# Altium project CarrierBoard.PrjPcb
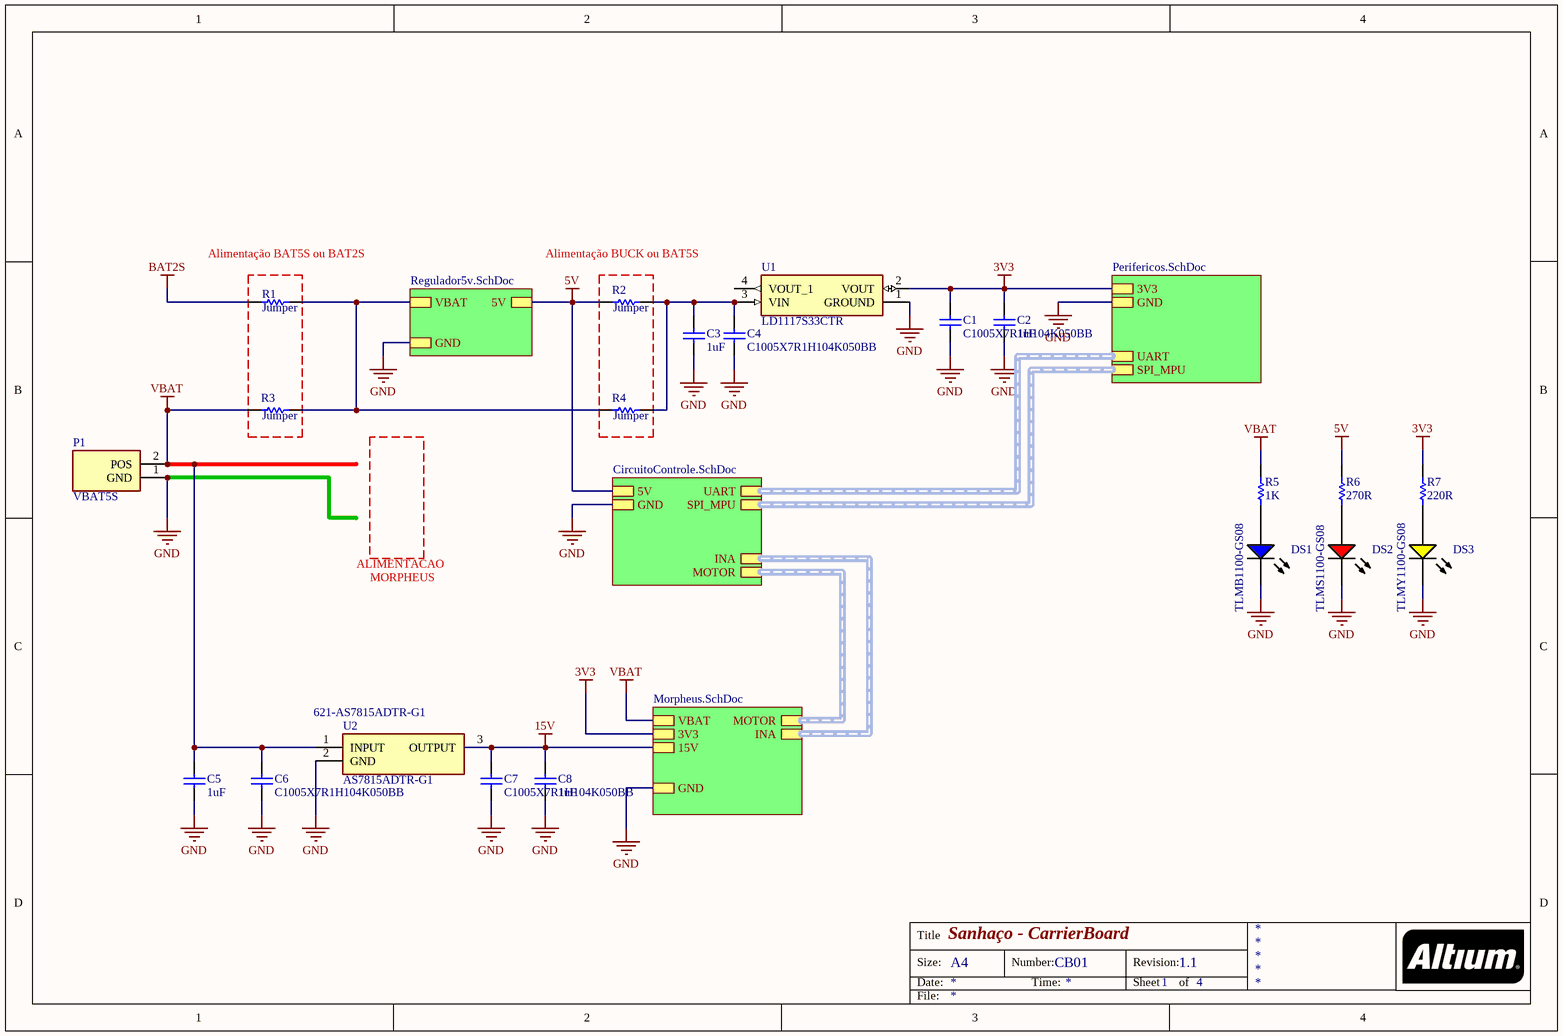
[diagram p0: CarrierBoard.SchDoc]
5 sheets, 58 parts. Net scope: hierarchical (ports join the sheet entries above them; power ports are global).
Board file: CarrierBoard.PcbDoc
Sheets:
  CarrierBoard.SchDoc
    Designator = Regulador5V.SchDoc
    Designator = Perifericos.SchDoc
    Designator = CircuitoControle.SchDoc
    Designator = Morpheus.SchDoc

## Sheet CarrierBoard.SchDoc: Sanhaço - CarrierBoard
size A4; DocumentNumber: CB01; Revision: 1.1; SheetNumber: 1; SheetTotal: 4; ProjectName: CarrierBoard - Sanhaço

### Parts
C1  C1005X7R1H104K050BB  [TDK-C1005-2_M]
C2  1uF  [CAPC1608X90X35ML10T15]
C3  1uF  [CAPC1608X90X35ML10T15]
C4  C1005X7R1H104K050BB  [TDK-C1005-2_M]
C5  1uF  [CAPC1608X90X35ML10T15]
C6  C1005X7R1H104K050BB  [TDK-C1005-2_M]
C7  C1005X7R1H104K050BB  [TDK-C1005-2_M]
C8  1uF  [CAPC1608X90X35ML10T15]
DS1  TLMB1100-GS08  [VISH-TLMX1100-2_V]
DS2  TLMS1100-GS08  [VISH-TLMX1100_V]
DS3  TLMY1100-GS08  [VISH-TLMX1100-2_V]
P1  VBAT5S  [SHDR2W320P716_1X2_1574X813X1588P]
R1  Jumper  [RESC0402(1005)_N]
R2  Jumper  [RESC0402(1005)_N]
R3  Jumper  [RESC0402(1005)_N]
R4  Jumper  [RESC0402(1005)_N]
R5  1K  [RESC0805(2012)_N]
R6  270R  [RESC0402(1005)_N]
R7  220R  [RESC1608X55X25NL10T15]
U1  LD1117S33CTR  [SOT230P700X190-4N]
U2  AS7815ADTR-G1  Supplier Part Number 1: 621-AS7815ADTR-G1  [ZLDO1117K50TC]

### Sub-sheets
Designator = Regulador5v.SchDoc: VBAT, 5V, GND
Designator = Perifericos.SchDoc: 3V3, GND, SPI_MPU (harness SPI_MPU), UART (harness UART)
Designator = CircuitoControle.SchDoc: 5V, GND, UART (harness UART), SPI_MPU (harness SPI_MPU), MOTOR (harness MOTOR), INA (harness INA)
Designator = Morpheus.SchDoc: 15V, GND, INA (harness INA), MOTOR (harness MOTOR), VBAT, 3V3

### Nets
3V3: C1.2 C2.2 R7.2 U1.2(VOUT) ; sheet Designator/3V3, sheet Designator/3V3
5V: R2.1 R6.2 ; sheet Designator/5V, sheet Designator/5V
15V: C7.2 C8.2 U2.3(OUTPUT) ; sheet Designator/15V
BAT2S: R1.1
GND: C1.1 C2.1 C3.1 C4.1 C5.1 C6.1 C7.1 C8.1 DS1.2(K) DS2.2(K) DS3.2(K) P1.1(GND) U1.1(GROUND) U2.2(GND) ; sheet Designator/GND, sheet Designator/GND, sheet Designator/GND, sheet Designator/GND  [project net 0]
VBAT: C5.2 C6.2 P1.2(POS) R3.1 R5.2 U2.1(INPUT) ; sheet Designator/VBAT
NetC3_2: C3.2 C4.2 R2.2 R4.2 U1.3(VIN)
NetC13_2: R1.2 R3.2 R4.1 ; sheet Designator/VBAT
NetDS1_1: DS1.1(A) R5.1
NetDS2_1: DS2.1(A) R6.1
NetDS3_1: DS3.1(A) R7.1

Not connected (* = marked no-connect by the designer): U1 4(VOUT_1)

### Notes on the sheet
- (near R1) Alimentação BAT5S ou BAT2S
- (near R2) Alimentação BUCK ou BAT5S
- ALIMENTACAO
- MORPHEUS
- Title
- Size:
- Date:
- A4
- Number:
- Time:
- Revision:
- Sheet
- of
- File:

### Library data of the parts
C1 C4 C6 C7 = CMP-2000-05393-1: Chip Capacitor, 0.1 uF, +/- 10%, 50 V, -55 to 125 degC, 0402(1005 Metric), RoHS, Tape and Reel; PCN Part Number: MLCCPartNumberChange30/Nov/2012; Manufacturer: TDK; Product Training Modules: CSeriesGeneralApplicationsSEAT,CCV,andTVCLDesignToolsGuidetoReplacinganElectrolyticCapacitorwithanMLCC; Other Names: 445-5932-1; Kits: 445-9021-KIT-ND-KITMLCC100PF-10UF04026.3-50V445-9003-KIT-ND-KITCAPCERHICAPMLCCSMD; Voltage - Rated: 50V; Temperature Coefficient: X7R; Capacitance: 0.1µF; Online Catalog: CSeries,GeneralPurpose; Manufacturer URL: http://www.tdk.com/; Category: Capacitors; Mounting Type: SurfaceMount,MLCC; Datasheet Version: Mar-15; Datasheet URL: http://www.farnell.com/datasheets/1913358.pdf; Packaging: CutTape(CT); Standard Package: 1; Features: -; Operating Temperature: -55degC~125degC; Tolerance: ±10%; RoHS Information: RoHSCertificate-MLCC; Applications: GeneralPurpose; Lead Style: -; Ratings: -; Height - Seated (Max): -; Lead Spacing: -; Package / Case: 0402(1005Metric); Series: C; Family: CeramicCapacitors
C2 C3 C5 C8 = CMP-2006-02823-1: MURATA   GRM188R61H105KAALD   Multilayer Ceramic Capacitor, GRM Series, 1 F,  10%, X5R, 50 V, 0603 [1608 Metric]; Dielectric: X7R; Voltage Rating: 50V; Manufacturer: Murata; Part Number: GRM188R61H105KAALD; Supplier 1: Mouser; Supplier Part Number 1: 81-GRM188R61H105KALD; Manufacturer Part Number: GRM188R61H105KAALD; Stock 1: 0; Mount: Surface Mount; Case/Package: 0603; Weight: 0.000222oz; Case Code (Metric): 1608; Case Code (Imperial): 0603; Material: Ceramic; Min Operating Temperature: -55°C; Max Operating Temperature: 85°C; Capacitance: 1uF; Tolerance: 10%; Packaging: Tape and Reel; Voltage: 50V; Termination: SMD/SMT; Composition: Ceramic; Voltage Rating (DC): 50V; Package Quantity: 4000; Length: 1.6mm; Height: 0.8mm; Width: 0.8mm; Thickness: 0.035inch; Depth: 0.8mm; Radiation Hardening: No; REACH SVHC: No SVHC; Lead Free: Lead Free; ComponentLink1URL: http://www.farnell.com/datasheets/2048611.pdf?src-supplier=Newark; ComponentLink1Description: http://www.farnell.com/datasheets/2048611.pdf?src-supplier=Newark; ComponentLink2URL: http://www.farnell.com/datasheets/1747450.pdf?src-supplier=Element14; ComponentLink2Description: http://www.farnell.com/datasheets/1747450.pdf?src-supplier=Element14; ComponentLink3URL: https://www.distrelec.biz/Web/Downloads/_t/ds/murata_MLCC_eng_tds.pdf?mime=application%2Fpdf&src-supplier=Distrelec; ComponentLink3Description: https://www.distrelec.biz/Web/Downloads/_t/ds/murata_MLCC_eng_tds.pdf?mime=application%2Fpdf&src-supplier=Distrelec; Datasheet: https://br.mouser.com/datasheet/2/281/murata_03052018_GRM_Series_1-1310166.pdf
DS1 = CMP-1666-00028-1: Blue LED, 10 mA, 3.9 V, -40 to 100 degC, 2-Pin SMD (0603), RoHS, Tape and Reel                  TLMB1100-GS08; Tolerance: 10%; Voltage Rating: 100 V; Capacitance: 10 nF; Type (Capacitors): X7R; Case\Package: Radial; ComponentLink1Description: Manufacturer URL; REACH SVHC: No SVHC; Package Quantity: 500; PackageDescription: 2-Pin Surface Mount Device, Body 1.6 x 0.8 mm; Pins: 2; ComponentLink2URL: http://download.siliconexpert.com/pdfs/2016/8/7/12/43/26/667/vsh_/manual/379263299541529tlmb1100.pdf; RoHSCompliant: true; Lead Pitch: 2.54 mm; Height: 2.54 mm; DatasheetVersion: Rev. 2.7, 03/2016; Length: 5.33 mm; ComponentLink1URL: http://www.vishay.com/; Min Operating Temperature: -55 degC; PackageReference: 0603; Packaging: Bulk; ComponentLink2Description: Datasheet; Max Operating Temperature: 125 degC; Radiation Hardening: No; Width: 3.81 mm; Mount: Through Hole
DS2 = CMP-1666-00027-1: LED, RED, 2.1 V, -40 to 100 degC, 2-Pin SMD (0603), RoHS, Tape and Reel; Type (Capacitors): C0G; Resistance: 100000000000 Ohm; Capacitance: 12 pF; Voltage Rating: 50 V; Tolerance: 5%; Min Operating Temperature: -55degC; REACH SVHC: No SVHC; ComponentLink2Description: Datasheet; ComponentLink1URL: http://www.vishay.com/; Width: 0.8 mm; Package Quantity: 4000; PackageReference: TLMX1100; ComponentLink2URL: http://www.vishay.com/docs/83173/tlmb1100.pdf; Case/Package: 0603; Case Code (Metric): 1608; Packaging: Tape and Reel; Pins: 2; ComponentLink1Description: Manufacturer URL; Max Operating Temperature: 125degC; Height: 0.8 mm; Length: 1.6 mm; Mount: Surface Mount; PackageDescription: 2-Pin Surface Mount Device, Body 1.6 x 0.8 mm; DatasheetVersion: Rev. 2.7, 03/2016; Case Code (Imperial): 0603; Voltage Rating (DC): 50 V; RoHSCompliant: True; Radiation Hardening: No
DS3 = CMP-1666-00030-1: Yellow LED, 20 mA, 2.1 V, -40 to 100 degC, 2-Pin SMD (0603), RoHS, Tape and Reel             TLMY1100-GS08; ComponentLink2Description: Datasheet; ComponentLink2URL: http://download.siliconexpert.com/pdfs/2016/8/7/12/43/26/667/vsh_/manual/379263299541529tlmb1100.pdf; ComponentLink1Description: Manufacturer URL; PackageDescription: 2-Pin Surface Mount Device, Body 1.6 x 0.8 mm; DatasheetVersion: Rev. 2.7, 03/2016; ComponentLink1URL: http://www.vishay.com/; PackageReference: 0603
P1 = PRT-10474: Connector; Manufacturer_Name: SparkFun; Datasheet Link: http://cdn.sparkfun.com/datasheets/Prototyping/xt60.pdf; Height: 15.875mm; Manufacturer_Part_Number: PRT-10474; Mouser Part Number: 474-PRT-10474; Mouser Price/Stock: https://www.mouser.com/Search/Refine.aspx?Keyword=474-PRT-10474
R1-R4 = CMP-1011-00001-1: Jumper 0402 (1005 Metric); Manufacturer: Vishay; Manufacturer Part Number: CRCW04020000Z0ED; Tolerance: None; Case-Metric: 1005; Case-EIA: 0402; Value: 0.00 Ohm; Resistance: 0mR; Power Rating: 63mW; Voltage Rating: 50V; Temperature Coefficient: 100ppm/°C; Power: None; Technology: SMT; Supplier 1: Mouser; Supplier Part Number 1: 71-CRCW0402-0-E3; Stock 1: 1223713; Pricing 1: 1=0.1, 10=0.017, 50=0.017, 100=0.007, 1000=0.005, 10000=0.004 (USD); Mount: Surface Mount; Case/Package: 0402; Weight: 2.3E-05oz; Contact Plating: Tin; Case Code (Imperial): 0402; Case Code (Metric): 1005; Min Operating Temperature: -55°C; Max Operating Temperature: 155°C; Composition: Thick Film; Termination: SMD/SMT; Packaging: Tape and Reel; Package Quantity: 1; Number of Terminations: 2; Military Standard: Not; Max Power Dissipation: 63mW; Voltage Rating (DC): 50V; Features: Automotive AEC-Q200; Length: 1mm; Height: 0.35mm; Width: 0.5mm; Depth: 0.5mm; Radiation Hardening: No; Lead Free: Lead Free; REACH SVHC: Unknown; ComponentLink1URL: http://www.vishay.com/docs/20035/dcrcwe3.pdf?src-supplier=Avnet+Europe; ComponentLink1Description: http://www.vishay.com/docs/20035/dcrcwe3.pdf?src-supplier=Avnet+Europe; ComponentLink2URL: http://www.vishay.com/docs/20035/dcrcwe3.pdf?src-supplier=Avnet; ComponentLink2Description: http://www.vishay.com/docs/20035/dcrcwe3.pdf?src-supplier=Avnet; ComponentLink3URL: http://www.vishay.com/docs/20035/dcrcwe3.pdf?src-supplier=Digi-Key; ComponentLink3Description: http://www.vishay.com/docs/20035/dcrcwe3.pdf?src-supplier=Digi-Key; ComponentLink4URL: http://www.farnell.com/datasheets/2111203.pdf?src-supplier=Element14; ComponentLink4Description: http://www.farnell.com/datasheets/2111203.pdf?src-supplier=Element14; ComponentLink5URL: http://www.vishay.com/docs/20035/dcrcwe3.pdf?src-supplier=Allied+Electronics; ComponentLink5Description: http://www.vishay.com/docs/20035/dcrcwe3.pdf?src-supplier=Allied+Electronics; ComponentLink6URL: https://www.distrelec.biz/Web/Downloads/a_/en/flD-CRCW-e3_data_en.pdf?mime=application%2Fpdf&src-supplier=Distrelec; ComponentLink6Description: https://www.distrelec.biz/Web/Downloads/a_/en/flD-CRCW-e3_data_en.pdf?mime=application%2Fpdf&src-supplier=Distrelec
R5 = CMP-1013-00074-1: 1K 0.125W 5% 0805 (2012 Metric)  SMD; Manufacturer: Yageo; Manufacturer Part Number: RC0805JR-071KL; Case-EIA: 0805; Case-Metric: 2012; Value: 1000.00 Ohm; Resistance: 1kR; Temperature Coefficient: 100ppm/°C; Power Rating: 125mW; Voltage Rating: 150V; Technology: SMT; Power: 0.125 W; Tolerance: 5 %; Supplier 1: Mouser; Supplier Part Number 1: 603-RC0805JR-071KL; Stock 1: 1222072; Pricing 1: 1=0.11, 10=0.026, 50=0.026, 100=0.009, 1000=0.007, 10000=0.004 (USD); Case/Package: 0805; Contact Plating: Tin,Lead,Matte; Case Code (Imperial): 0805; Case Code (Metric): 2012; Min Operating Temperature: -55°C; Max Operating Temperature: 155°C; Composition: Thick Film; Packaging: Tape and Reel; Termination: SMD/SMT; Military Standard: Not; Length: 2mm; Depth: 1.25mm; Radiation Hardening: No; REACH SVHC: Unknown; Lead Free: Lead Free; ComponentLink1URL: http://www.farnell.com/datasheets/2167052.pdf?src-supplier=Verical; ComponentLink1Description: http://www.farnell.com/datasheets/2167052.pdf?src-supplier=Verical; ComponentLink2URL: http://www.farnell.com/datasheets/2167052.pdf?src-supplier=Mouser; ComponentLink2Description: http://www.farnell.com/datasheets/2167052.pdf?src-supplier=Mouser; ComponentLink3URL: http://www.farnell.com/datasheets/442941.pdf?src-supplier=Element14; ComponentLink3Description: http://www.farnell.com/datasheets/442941.pdf?src-supplier=Element14; ComponentLink4URL: http://www.farnell.com/datasheets/444164.pdf?src-supplier=Element14; ComponentLink4Description: http://www.farnell.com/datasheets/444164.pdf?src-supplier=Element14
R6 = CMP-1011-00060-1: 270R 0.063W 5% 0402 (1005 Metric)  SMD                             603-AC0402JR-07270RL; Manufacturer: Yageo; Case-Metric: 1005; Value: 270.00 Ohm; Case-EIA: 0402; Max Power Dissipation: 63mW; Temperature Coefficient: 100ppm/°C; Tolerance: 5 %; Technology: SMT; Power: 0.063 W; Supplier 1: Mouser; Supplier Part Number 1: 603-AC0402JR-07270RL; Manufacturer Part Number: AC0402JR-07270RL; Stock 1: 82259; Pricing 1: 1=0.1, 10=0.015, 50=0.015, 100=0.005, 1000=0.004, 10000=0.004 (USD); Case/Package: 0402; Case Code (Metric): 1005; Case Code (Imperial): 0402; Min Operating Temperature: -55°C; Max Operating Temperature: 155°C; Packaging: Tape and Reel; Resistance: 270R; Composition: Thick Film; Number of Terminations: 2; Features: Moisture Resistant,Automotive AEC-Q200; Length: 0.039inch; Height: 0.015inch; Width: 0.02inch
R7 = CMP-2000-04878-1: Res 0603 220 Ohm 5% 0.1W(1/10W) ±100ppm/C Sulfur Resistant Pad SMD Automotive T/R; Manufacturer: Yageo; Part Number: AF0603FR-07130RL; Manufacturer Part Number 1: AF0603JR-07220RL; Description: RES SMD 220 OHM 5% 1/10W 0603; Max Power Dissipation: 100mW; Temperature Coefficient: 100ppm/°C; Supplier 1: Mouser; Supplier Part Number 1: 603-AF0603JR-07220RL; Manufacturer 1: Yageo; Stock 1: 9358; Pricing 1: 1=0,12000, 10=0,02700, 50=0,02700, 100=0,00900, 1000=0,00800, 10000=0,00500 (USD); RoHS: Yes; Case/Package: 0603; Min Operating Temperature: -55°C; Max Operating Temperature: 155°C; Packaging: Tape and Reel; Resistance: 220R; Composition: Thick Film; Number of Terminations: 2; Tolerance: 5%; Features: Moisture Resistant; Length: 0.063inch; Height: 0.022inch; Width: 0.031inch; Lead Free: Lead Free; ComponentLink1URL: http://www.yageo.com/documents/recent/PYu-AF_51_RoHS_L_5.pdf?src-supplier=Digi-Key; ComponentLink1Description: http://www.yageo.com/documents/recent/PYu-AF_51_RoHS_L_5.pdf?src-supplier=Digi-Key
U1 = LD1117S33CTR: Integrated Circuit; Manufacturer_Name: STMicroelectronics; Allied_Number: 70390200; Datasheet Link: http://www.st.com/st-web-ui/static/active/en/resource/technical/document/datasheet/CD00000544.pdf; Height: 1.9mm; Manufacturer_Part_Number: LD1117S33CTR; Mouser Part Number: 511-LD1117S33C; Mouser Price/Stock: https://www.mouser.com/Search/Refine.aspx?Keyword=511-LD1117S33C; RS Part Number: 1657750; RS Price/Stock: http://uk.rs-online.com/web/p/products/1657750; Allied Price/Stock: http://www.alliedelec.com/stmicroelectronics-ld1117s33ctr/70390200/
U2 = AS7805ADTR-G1: Integrated Circuit; Manufacturer_Name: Diodes Inc.; Manufacturer: Diodes; Output Voltage: 15V; Output Current: 1A; Dropout Voltage: 2V; Number of Regulators: 1; Datasheet Link: https://www.diodes.com/assets/Datasheets/AS78XXA.pdf; Height: 2mm; Manufacturer_Part_Number: AS7805ADTR-G1; Mouser Part Number: 621-AS7805ADTR-G1; Mouser Price/Stock: https://www.mouser.com/Search/Refine.aspx?Keyword=621-AS7805ADTR-G1; Supplier 1: Mouser; Manufacturer Part Number: AS7815ADTR-G1; Stock 1: 1565; Pricing 1: 1=0.43, 10=0.354, 50=0.354, 100=0.216, 1000=0.167, 10000=0.142 (USD); Mount: Surface Mount; Case/Package: TO-252-3; Min Operating Temperature: -40°C; Max Operating Temperature: 125°C; Packaging: Tape and Reel

## Sheet Regulador5V.SchDoc: Sanhaço - Regulador 5v
size A4; DocumentNumber: CB02; Revision: 1.1; SheetNumber: 2; SheetTotal: 4; ProjectName: Sanhaço
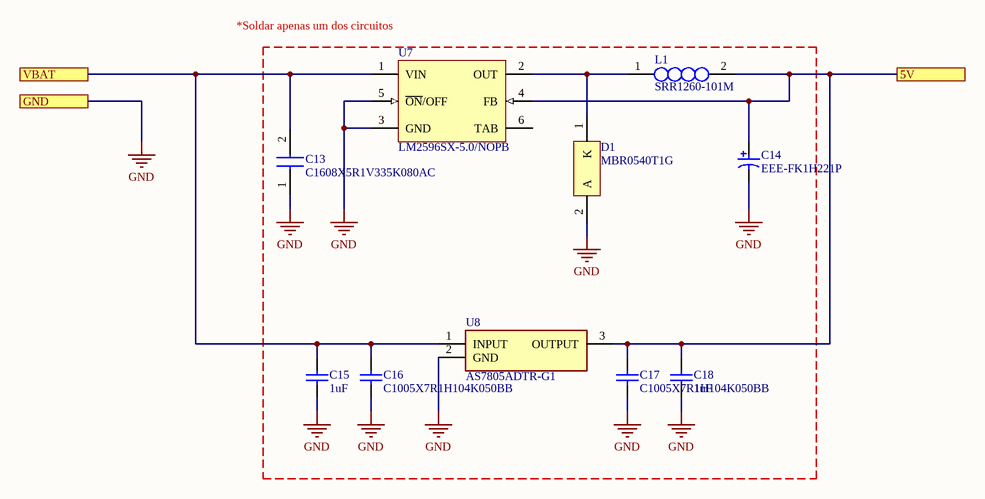
[diagram p1: Regulador5V.SchDoc]

### Parts
C13  C1608X5R1V335K080AC  [CAPC1608X80N]
C14  EEE-FK1H221P  [PNSC-EEE-1HA221P_L]
C15  1uF  [CAPC1608X90X35ML10T15]
C16  C1005X7R1H104K050BB  [TDK-C1005-2_M]
C17  C1005X7R1H104K050BB  [TDK-C1005-2_M]
C18  1uF  [CAPC1608X90X35ML10T15]
D1  MBR0540T1G  [ONSC-SOD-123-2-425-04_V]
L1  SRR1260-101M  [*INDP125125X600N]
U7  LM2596SX-5.0/NOPB  [TS5B_M]
U8  AS7805ADTR-G1  [ZLDO1117K50TC]

### Ports
5V, GND, VBAT

### Nets
5V: C14.1 C17.2 C18.2 L1.2 U7.4(FB) U8.3(OUTPUT) ; port 5V
GND: C13.1 C14.2 C15.1 C16.1 C17.1 C18.1 D1.2(A) U7.3(GND) U7.5(~{ON}/OFF) U8.2(GND) ; port GND  [project net 0]
NetC13_2: C13.2 C15.2 C16.2 U7.1(VIN) U8.1(INPUT) ; port VBAT
NetD1_1: D1.1(K) L1.1 U7.2(OUT)

Not connected (* = marked no-connect by the designer): U7 6(TAB)

### Notes on the sheet
- (near U7) *Soldar apenas um dos circuitos
- Title
- Size:
- Date:
- A4
- Number:
- Time:
- Revision:
- Sheet
- of
- File:

### Library data of the parts
C13 = C1608X5R1V335K080AC: Capacitor 3.3uF; Manufacturer_Name: TDK; Dielectric Material: Ceramic; Tolerance: 10%; Voltage Rating: 35V; Dielectric: X5R; Datasheet Link: https://product.tdk.com/info/en/catalog/datasheets/mlcc_commercial_midvoltage_en.pdf; Height: 0.8mm; Manufacturer_Part_Number: C1608X5R1V335K080AC; Mouser Part Number: 810-C1608X5R1V335KAC; Mouser Price/Stock: https://www.mouser.com/Search/Refine.aspx?Keyword=810-C1608X5R1V335KAC; Supplier 1: Digi-Key; Supplier Part Number 1: 445-14167-1-ND; Manufacturer: TDK; Manufacturer Part Number: C1608X5R1V335K080AC; Stock 1: 4798; Pricing 1: 1 = 0,45000, 10 = 0,31100, 100 = 0,18630, 500 = 0,13972, 1000 = 0,11799 (USD); RoHS: Yes; Mount: Surface Mount; Case/Package: 0603; Weight: 7.1E-05oz; Case Code (Metric): 1608; Case Code (Imperial): 0603; Min Operating Temperature: -55°C; Max Operating Temperature: 85°C; Package Quantity: 4000; Packaging: Tape and Reel; Capacitance: 3.3uF; Termination: SMD/SMT; Voltage Rating (DC): 35V; Length: 0.063inch; Width: 0.8mm; Thickness: 0.035inch; Lead Free: Lead Free; ComponentLink1URL: https://datasheet.ciiva.com/14909/tdkmlcccaprange-14909925.pdf?src-supplier=Digi-Key; ComponentLink1Description: https://datasheet.ciiva.com/14909/tdkmlcccaprange-14909925.pdf?src-supplier=Digi-Key; ComponentLink2URL: https://datasheet.ciiva.com/14909/tdkmlcccaprange-14909926.pdf?src-supplier=Digi-Key; ComponentLink2Description: https://datasheet.ciiva.com/14909/tdkmlcccaprange-14909926.pdf?src-supplier=Digi-Key
C14 = CMP-2000-06200-1: Aluminum Electrolytic Capacitor, 220 uF, +/- 20%, 50 V, -40 to 85 degC, 2-Pin SMD, RoHS, Tape and Reelhttps://br.mouser.com/ProductDetail/Panasonic/EEE-FK1H221P?qs=%2Fha2pyFaduioJWBrqH8qNcijPCQSw77%252BpLytlHuDdeup2lEE5e2lgA%3D%3D; Lifetime @ Temperature: 2000hours@85°C; AE Capacitor Case: RadialCan-SMD; Capacitance: 220µF; Ripple Current AC: 300mA; SVHC: ToBeAdvised; Voltage Rating: 50V; Product Range: PANASONIC-SSeries; Manufacturer: Panasonic; Datasheet Version: 11/2012; Manufacturer URL: http://www.panasonic.com/; Packaging: CutTape; Life Time @ Temperature: 2000hours@85°C; Capacitor Case Style: RadialCan-SMD; Capacitance Tolerance ±: ±20%; Mounting Technology: SurfaceMount; Operating Temperature Max: 85°C; Capacitance Tolerance: ±20%; Package Description: 2-Pin Surface Mount Device, Body 10.3 x 10.3 mm; Package Reference: SMD; Diameter: 10mm; Height: 10.2mm; Operating Temperature Min: -40°C; Datasheet URL: https://br.mouser.com/datasheet/2/315/ABA0000C1181-947564.pdf
C15 C18 = CMP-2006-02823-1: as C2 on sheet CarrierBoard; Manufacturer: Murata; Part Number: GRM188R61H105KAALD; Supplier 1: Mouser; Supplier Part Number 1: 81-GRM188R61H105KALD; Manufacturer Part Number: GRM188R61H105KAALD; Stock 1: 0; Mount: Surface Mount; Case/Package: 0603; Weight: 0.000222oz; Case Code (Metric): 1608; Case Code (Imperial): 0603; Material: Ceramic; Min Operating Temperature: -55°C; Max Operating Temperature: 85°C; Capacitance: 1uF; Tolerance: 10%; Packaging: Tape and Reel; Voltage: 50V; Termination: SMD/SMT; Composition: Ceramic; Voltage Rating (DC): 50V; Package Quantity: 4000; Length: 1.6mm; Height: 0.8mm; Width: 0.8mm; Thickness: 0.035inch; Depth: 0.8mm; Radiation Hardening: No; REACH SVHC: No SVHC; Lead Free: Lead Free; ComponentLink1URL: http://www.farnell.com/datasheets/2048611.pdf?src-supplier=Newark; ComponentLink1Description: http://www.farnell.com/datasheets/2048611.pdf?src-supplier=Newark; ComponentLink2URL: http://www.farnell.com/datasheets/1747450.pdf?src-supplier=Element14; ComponentLink2Description: http://www.farnell.com/datasheets/1747450.pdf?src-supplier=Element14; ComponentLink3URL: https://www.distrelec.biz/Web/Downloads/_t/ds/murata_MLCC_eng_tds.pdf?mime=application%2Fpdf&src-supplier=Distrelec; ComponentLink3Description: https://www.distrelec.biz/Web/Downloads/_t/ds/murata_MLCC_eng_tds.pdf?mime=application%2Fpdf&src-supplier=Distrelec; Datasheet: https://br.mouser.com/datasheet/2/281/murata_03052018_GRM_Series_1-1310166.pdf
C16 C17 = CMP-2000-05393-1: as C1 on sheet CarrierBoard; Manufacturer URL: http://www.tdk.com/; Category: Capacitors; Mounting Type: SurfaceMount,MLCC; Datasheet Version: Mar-15; Datasheet URL: http://www.farnell.com/datasheets/1913358.pdf; Packaging: CutTape(CT); Standard Package: 1; Features: -; Operating Temperature: -55degC~125degC; Tolerance: ±10%; RoHS Information: RoHSCertificate-MLCC; Applications: GeneralPurpose; Lead Style: -; Ratings: -; Height - Seated (Max): -; Lead Spacing: -; Package / Case: 0402(1005Metric); Series: C; Family: CeramicCapacitors
D1 = CMP-1055-00401-1: Schottky Power Rectifier, 2-Pin SOD-123, Pb-Free, Tape and Reel; Manufacturer: On Semiconductor; IFSM Max (A): 5.5; Configuration: Single; ComponentLink1URL: http://www.onsemi.com/; ComponentLink3Description: Package Specification; RoHS: TRUE; PackageVersion: Rev. G, 10/2009; DatasheetVersion: Rev. 7; ComponentLink3URL: http://www.onsemi.com/pub_link/Collateral/425-04.PDF; Packing: Tape and Reel; ComponentLink1Description: Manufacturer URL; PackageDescription: 2-Pin SOD, Body 1.6 x 2.69 mm; PartNumber: MBR0540T1G; ComponentLink2Description: Datasheet; ComponentLink2URL: http://www.onsemi.cn/pub_link/Collateral/MBR0540T1-D.PDF; PackageReference: SOD-123-2-425-04; Mounting Technology: Surface Mount; Datasheet: https://br.mouser.com/datasheet/2/315/ABA0000C1181-947564.pdf
L1 = SRR1260-220M: FIXED IND 100UH 1.7A 180 MOHM; Manufacturer_Name: Bourns; Allied_Number: 70277063; Core Material: Ferrite; Material: Steel; Tolerance: 20%; DC Resistance (DCR): 180mR; Shielding: Shielded; Self Resonant Frequency: 6.07MHz; Q Factor: 26; Test Frequency: 100kHz; Datasheet Link: https://componentsearchengine.com/Datasheets/2/SRR1260-220M.pdf; Manufacturer_Part_Number: SRR1260-220M; Mouser Part Number: 652-SRR1260-220M; Mouser Price/Stock: https://www.mouser.com/Search/Refine.aspx?Keyword=652-SRR1260-220M; RS Part Number: 7272246P; RS Price/Stock: http://uk.rs-online.com/web/p/products/7272246P; Allied Price/Stock: https://www.alliedelec.com/bourns-srr1260-220m/70277063/; Supplier 1: Mouser; Supplier Part Number 1: 652-SRR1260-101M; Manufacturer: Bourns; Manufacturer Part Number: SRR1260-101M; Stock 1: 6993; Pricing 1: 1=0.97, 10=0.833, 50=0.694, 100=0.652, 1000=0.447, 10000=0.446 (USD); Mount: Surface Mount; Case/Package: 1260; Number of Pins: 2; Min Operating Temperature: -40°C; Max Operating Temperature: 125°C; Inductance: 100uH; Max DC Current: 1.7A; Termination: SMD/SMT; Package Quantity: 600; Current Rating: 1.7A; Saturation Current: 1.7A; Packaging: Tape and Reel; Frequency: 6.07MHz; Inductance Tolerance: 20%; Resistance: 180MR; Composition: Wirewound; RMS Current (Irms): 1.7A; DC Current: 1.7A; Military Standard: Not; Length: 12.5mm; Height: 6mm; Width: 12.5mm; Height - Seated (Max): 0.256inch; Depth: 12.8mm; REACH SVHC: No SVHC; ComponentLink1URL: http://www.bourns.com/docs/Product-Datasheets/SRR1260.pdf?src-supplier=Digi-Key; ComponentLink1Description: http://www.bourns.com/docs/Product-Datasheets/SRR1260.pdf?src-supplier=Digi-Key; ComponentLink2URL: http://uk.rs-online.com/webdocs/0def/0900766b80defded.pdf?src-supplier=RSComponents; ComponentLink2Description: http://uk.rs-online.com/webdocs/0def/0900766b80defded.pdf?src-supplier=RSComponents; ComponentLink3URL: http://www.farnell.com/datasheets/1430852.pdf?src-supplier=Element14; ComponentLink3Description: http://www.farnell.com/datasheets/1430852.pdf?src-supplier=Element14; ComponentLink4URL: http://www.farnell.com/datasheets/1914016.pdf?src-supplier=Element14; ComponentLink4Description: http://www.farnell.com/datasheets/1914016.pdf?src-supplier=Element14; ComponentLink5URL: http://www.bourns.com/pdfs/SRR1260.pdf?src-supplier=Avnet; ComponentLink5Description: http://www.bourns.com/pdfs/SRR1260.pdf?src-supplier=Avnet; ComponentLink6URL: http://www.farnell.com/datasheets/2366825.pdf?src-supplier=Newark; ComponentLink6Description: http://www.farnell.com/datasheets/2366825.pdf?src-supplier=Newark; ComponentLink7URL: https://www.alliedelec.com/m/d/845565468e1e76a1db638ca94afd232b.pdf?src-supplier=Allied+Electronics; ComponentLink7Description: https://www.alliedelec.com/m/d/845565468e1e76a1db638ca94afd232b.pdf?src-supplier=Allied+Electronics
U7 = CMP-0069-00282-2: SIMPLE SWITCHER® Power Converter 150 KHz 3A Step-Down Voltage Regulator, 5-pin TO-263; Manufacturer: Texas Instruments; PowerWise: N; PackageTopMarking: NSUZXYTTE#*LM2596S*-5.0 P+; RevisionNote: Component URLs added; ComponentLink3URL: http://www.national.com/packaging/folders/ts5b.html; Code_JEDEC: MO-169-AB; ComponentLink1Description: LM2596 Datasheet; DatasheetVersion: May-2002; ComponentLink2Description: LM2596 Web Page; PackageReference: TS5B; PackageDescription: TO-263, Molded, .400 x .390 x .180in, 5 Lead, .067in Pitch, Surface Mount; CompType: Switcher; ComponentLink1URL: http://www.national.com/ds/LM/LM2596.pdf; ComponentLink3Description: TS5B Package Page; PinCount: 5; RoHS: N; ComponentLink2URL: http://www.national.com/pf/LM/LM2596.html
U8 = AS7805ADTR-G1: Integrated Circuit; Manufacturer_Name: Diodes Inc.; Datasheet Link: https://www.diodes.com/assets/Datasheets/AS78XXA.pdf; Height: 2mm; Manufacturer_Part_Number: AS7805ADTR-G1; Mouser Part Number: 621-AS7805ADTR-G1; Mouser Price/Stock: https://www.mouser.com/Search/Refine.aspx?Keyword=621-AS7805ADTR-G1

## Sheet Perifericos.SchDoc: Sanhaço - Periféricos
size A4; DocumentNumber: CB04; Revision: 1.1; SheetNumber: 4; SheetTotal: 4; ProjectName: Sanhaço
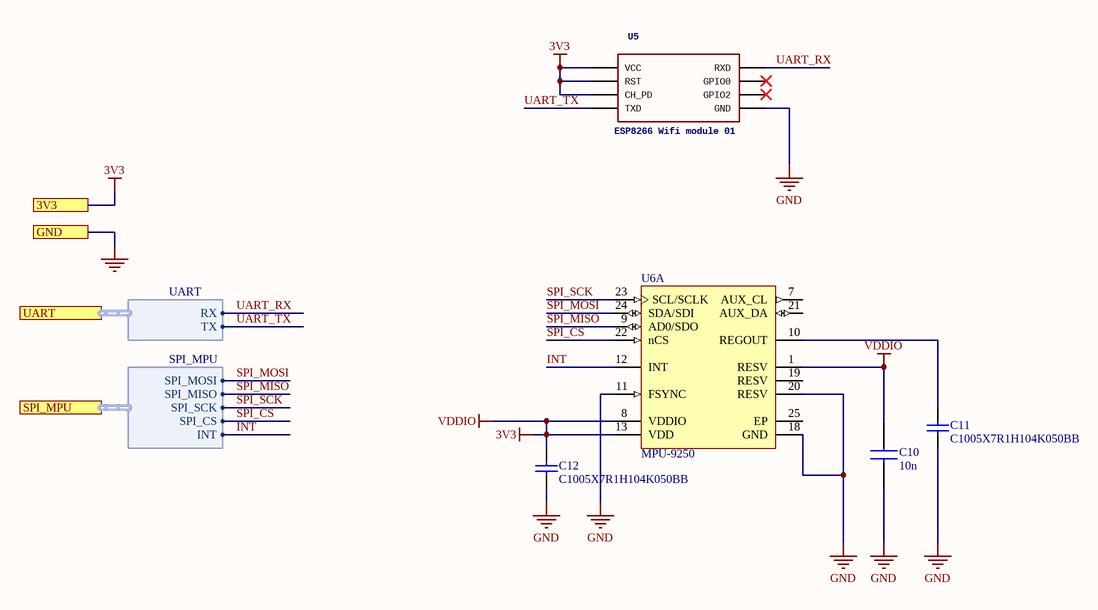
[diagram p2: Perifericos.SchDoc]

### Parts
C10  10n  [CAPC1005X55N]
C11  C1005X7R1H104K050BB  [TDK-C1005-2_M]
C12  C1005X7R1H104K050BB  [TDK-C1005-2_M]
U5  ESP8266 Wifi module 01  [ESP01]
U6  MPU-9250  [INSE-QFN-24-1700X1540TP_L]  (part A of 2)

### Ports
3V3, GND, SPI_MPU (harness SPI_MPU), UART (harness UART)

### Harnesses
UART: RX, TX
SPI_MPU: SPI_MOSI, SPI_MISO, SPI_SCK, SPI_CS, INT

### Nets
0: C10.2 C11.1 C12.1 U5.GND U6.11(FSYNC) U6.18(GND) U6.20(RESV) ; port GND  [also labelled GND]
3V3: C10.1 C12.2 U5.CH_PD U5.RST U5.VCC U6.1(RESV) U6.8(VDDIO) U6.13(VDD) ; port 3V3  [also labelled VDDIO]
INT: U6.12(INT) ; port SPI_MPU.INT
SPI_CS: U6.22(nCS) ; port SPI_MPU.SPI_CS
SPI_MISO: U6.9(AD0/SDO) ; port SPI_MPU.SPI_MISO
SPI_MOSI: U6.24(SDA/SDI) ; port SPI_MPU.SPI_MOSI
SPI_SCK: U6.23(SCL/SCLK) ; port SPI_MPU.SPI_SCK
UART_RX: U5.RX(RXD) ; port UART.RX
UART_TX: U5.TX(TXD) ; port UART.TX
NetC11_2: C11.2 U6.10(REGOUT)

Not connected (* = marked no-connect by the designer): U5 GPIO0* GPIO2*; U6 7(AUX_CL) 19(RESV) 21(AUX_DA) 25(EP)

### Notes on the sheet
- Title
- Size:
- Date:
- A4
- Number:
- Time:
- Revision:
- Sheet
- of
- File:

### Library data of the parts
C10 = GRM155R71E103JA01J: Capacitor; Manufacturer_Name: Murata Electronics; Manufacturer 1: Murata; Description: Multilayer Ceramic Capacitors MLCC - SMD/SMT 0402 0.01uF 25volts X7R 5%; Tolerance: 5%; Capacitance: 10nF; Voltage Rating: 25V; Dielectric: X7R; Datasheet Link: http://www.murata.com/~/media/webrenewal/support/library/catalog/products/capacitor/mlcc/c02e.pdf; Height: 0.55mm; Manufacturer_Part_Number: GRM155R71E103JA01J; Mouser Part Number: 81-GRM155R71E103JA1J; Mouser Price/Stock: https://www.mouser.com/Search/Refine.aspx?Keyword=81-GRM155R71E103JA1J; Supplier 1: Digi-Key; Supplier Part Number 1: 490-6340-1-ND; Manufacturer Part Number 1: GRM155R71E103JA01J; Stock 1: 414697; Pricing 1: 1=0,10000, 10=0,03500, 100=0,01580, 500=0,01128, 1000=0,00886, 2500=0,00805, 5000=0,00741 (USD); RoHS: Yes; Mount: Surface Mount; Case/Package: 0402; Case Code (Metric): 1005; Case Code (Imperial): 0402; Min Operating Temperature: -55°C; Max Operating Temperature: 125°C; Packaging: Tape and Reel; Package Quantity: 50000; Voltage Rating (DC): 25V; Termination: SMD/SMT; Length: 1mm; Width: 0.02inch; Thickness: 0.022inch; Depth: 0.5mm; Radiation Hardening: No; Lead Free: Lead Free; ComponentLink1URL: https://datasheet.ciiva.com/5413/product-5413481.pdf?src-supplier=Mouser; ComponentLink1Description: https://datasheet.ciiva.com/5413/product-5413481.pdf?src-supplier=Mouser; ComponentLink2URL: https://datasheet.ciiva.com/6263/partnumbering-e-01-6263653.pdf?src-supplier=Digi-Key; ComponentLink2Description: https://datasheet.ciiva.com/6263/partnumbering-e-01-6263653.pdf?src-supplier=Digi-Key; ComponentLink3URL: https://datasheet.ciiva.com/6263/partnumbering-e-01-6263656.pdf?src-supplier=Digi-Key; ComponentLink3Description: https://datasheet.ciiva.com/6263/partnumbering-e-01-6263656.pdf?src-supplier=Digi-Key; ComponentLink4URL: https://datasheet.ciiva.com/6263/partnumbering-e-01-6263659.pdf?src-supplier=Digi-Key; ComponentLink4Description: https://datasheet.ciiva.com/6263/partnumbering-e-01-6263659.pdf?src-supplier=Digi-Key; ComponentLink5URL: https://datasheet.ciiva.com/11619/c02e-11619963.pdf?src-supplier=Avnet; ComponentLink5Description: https://datasheet.ciiva.com/11619/c02e-11619963.pdf?src-supplier=Avnet
C11 C12 = CMP-2000-05393-1: as C1 on sheet CarrierBoard; Manufacturer URL: http://www.tdk.com/; Category: Capacitors; Mounting Type: SurfaceMount,MLCC; Datasheet Version: Mar-15; Datasheet URL: http://www.farnell.com/datasheets/1913358.pdf; Packaging: CutTape(CT); Standard Package: 1; Features: -; Operating Temperature: -55degC~125degC; Tolerance: ±10%; RoHS Information: RoHSCertificate-MLCC; Applications: GeneralPurpose; Lead Style: -; Ratings: -; Height - Seated (Max): -; Lead Spacing: -; Package / Case: 0402(1005Metric); Series: C; Family: CeramicCapacitors
U5 = ESP01: ESP-01; GateName_1: G$1; SymbolName_1: ESP01; LibraryName: esp8266modules; DeviceSetName: ESP01; Package: ESP01
U6 = CMP-2100-03657-1: 9-axis MotionTracking device, 2.4 to 3,6 V, -40 to 85 degC, 24-Pin QFN, RoHS, Tape and Reel; Manufacturer: InvenSense; Max Supply Voltage: 3.6V; Min Supply Voltage: 2.4V; Package Reference: QFN-24; Package Quantity: 1; Datasheet Version: Rev. 1.0, 01/2014; Case/Package: QFN; Package Description: 24-Pin Quad Flat No-lead Package, Body 3 x 3 mm, Pitch 0.4 mm; Datasheet URL: http://datasheet.octopart.com/MPU-9250-InvenSense-datasheet-21859386.pdf; RoHSCompliant: true; Max Operating Temperature: 85degC; Height: 1mm; Mount: SurfaceMount; Manufacturer URL: http://www.invensense.com/; Width: 3.1mm; Min Operating Temperature: -40degC; Length: 3.1mm

## Sheet CircuitoControle.SchDoc: Sanhaço - Ckt Controle
size A4; DocumentNumber: CB03; Revision: 1.1; SheetNumber: 3; SheetTotal: 4
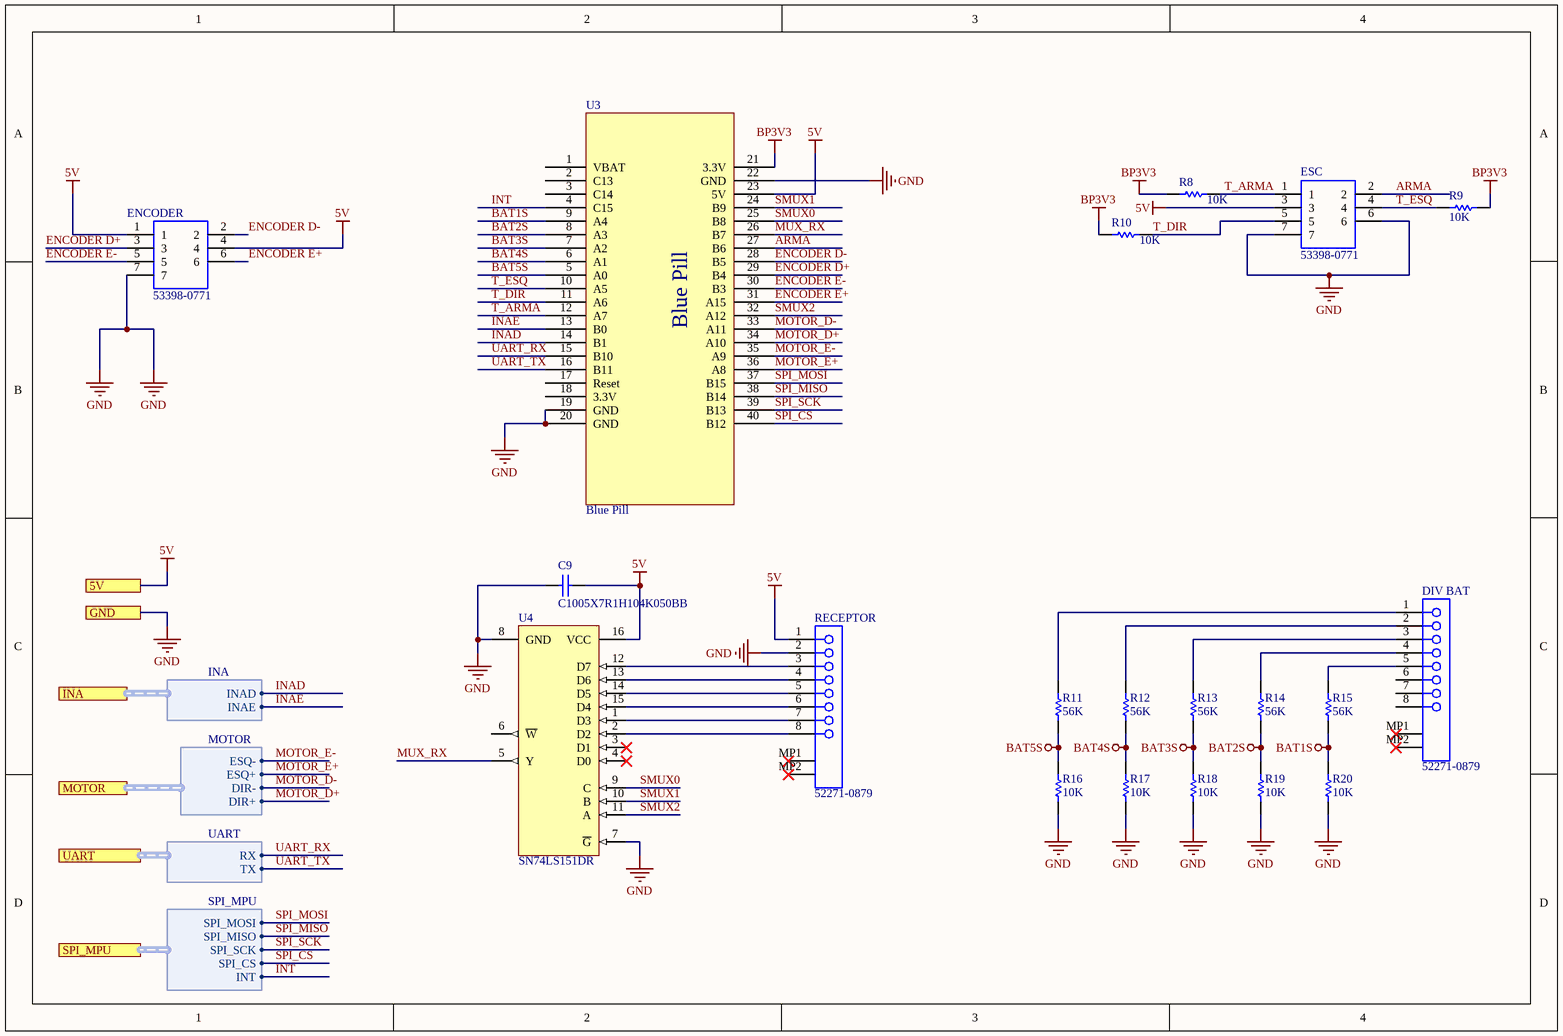
[diagram p3: CircuitoControle.SchDoc]

### Parts
C9  C1005X7R1H104K050BB  [TDK-C1005-2_M]
DIV_BAT  52271-0879  [MOLX-52271-0879]
ENCODER  53398-0771  [53398-0771]
ESC  53398-0771  [53398-0771]
R8  10K  [RESC0402(1005)_L]
R9  10K  [RESC0402(1005)_L]
R10  10K  [RESC0402(1005)_L]
R11  56K  [RESC0402(1005)_N]
R12  56K  [RESC0402(1005)_N]
R13  56K  [RESC0402(1005)_N]
R14  56K  [RESC0402(1005)_N]
R15  56K  [RESC0402(1005)_N]
R16  10K  [RESC0402(1005)_L]
R17  10K  [RESC0402(1005)_L]
R18  10K  [RESC0402(1005)_L]
R19  10K  [RESC0402(1005)_L]
R20  10K  [RESC0402(1005)_L]
RECEPTOR  52271-0879  [MOLX-52271-0879]
U3  Blue Pill  [blue pill]
U4  SN74LS151DR  [D0016A_L]

### Ports
5V, GND, INA (harness INA), MOTOR (harness MOTOR), SPI_MPU (harness SPI_MPU), UART (harness UART)

### Harnesses
UART: RX, TX
SPI_MPU: SPI_MOSI, SPI_MISO, SPI_SCK, SPI_CS, INT
INA: INAD, INAE
MOTOR: ESQ+, DIR-, DIR+, ESQ-

### Nets
5V: C9.2 ENCODER.1 ENCODER.4 ESC.3 RECEPTOR.1 U3.23(5V) U4.16(VCC) ; port 5V
BAT1S: R15.1 R20.2 U3.9(A4)
BAT2S: R14.1 R19.2 U3.8(A3)
BAT3S: R13.1 R18.2 U3.7(A2)
BAT4S: R12.1 R17.2 U3.6(A1)
BAT5S: R11.1 R16.2 U3.5(A0)
BP3V3: R8.2 R9.1 R10.2 U3.21(3.3V)
GND: C9.1 ENCODER.7 ESC.6 ESC.7 R16.1 R17.1 R18.1 R19.1 R20.1 RECEPTOR.2 U3.19(GND) U3.20(GND) U3.22(GND) U4.7(~{G}) U4.8(GND) ; port GND  [project net 0]
ARMA: ESC.2 U3.27(B6)
ENCODER D+: ENCODER.3 U3.29(B4)
ENCODER D-: ENCODER.2 U3.28(B5)
ENCODER E+: ENCODER.6 U3.31(A15)
ENCODER E-: ENCODER.5 U3.30(B3)
INAD: U3.14(B1) ; port INA.INAD
INAE: U3.13(B0) ; port INA.INAE
INT: U3.4(C15) ; port SPI_MPU.INT
MOTOR_D+: U3.34(A10) ; port MOTOR.DIR+
MOTOR_D-: U3.33(A11) ; port MOTOR.DIR-
MOTOR_E+: U3.36(A8) ; port MOTOR.ESQ+
MOTOR_E-: U3.35(A9) ; port MOTOR.ESQ-
MUX_RX: U3.26(B7) U4.5(Y)
SMUX0: U3.25(B8) U4.9(C)
SMUX1: U3.24(B9) U4.10(B)
SMUX2: U3.32(A12) U4.11(A)
SPI_CS: U3.40(B12) ; port SPI_MPU.SPI_CS
SPI_MISO: U3.38(B14) ; port SPI_MPU.SPI_MISO
SPI_MOSI: U3.37(B15) ; port SPI_MPU.SPI_MOSI
SPI_SCK: U3.39(B13) ; port SPI_MPU.SPI_SCK
T_ARMA: ESC.1 R8.1 U3.12(A7)
T_DIR: ESC.5 R10.1 U3.11(A6)
T_ESQ: ESC.4 R9.2 U3.10(A5)
UART_RX: U3.15(B10) ; port UART.RX
UART_TX: U3.16(B11) ; port UART.TX
NetDIV_BAT_1: DIV_BAT.1 R11.2
NetDIV_BAT_2: DIV_BAT.2 R12.2
NetDIV_BAT_3: DIV_BAT.3 R13.2
NetDIV_BAT_4: DIV_BAT.4 R14.2
NetDIV_BAT_5: DIV_BAT.5 R15.2
NetRECEPTOR_3: RECEPTOR.3 U4.12(D7)
NetRECEPTOR_4: RECEPTOR.4 U4.13(D6)
NetRECEPTOR_5: RECEPTOR.5 U4.14(D5)
NetRECEPTOR_6: RECEPTOR.6 U4.15(D4)
NetRECEPTOR_7: RECEPTOR.7 U4.1(D3)
NetRECEPTOR_8: RECEPTOR.8 U4.2(D2)

Not connected (* = marked no-connect by the designer): DIV_BAT 6 7 8 MP1* MP2*; RECEPTOR MP1* MP2*; U3 1(VBAT) 2(C13) 3(C14) 17(Reset) 18(3.3V); U4 3(D1)* 4(D0)* 6(~{W})

### Notes on the sheet
- Title
- Size:
- Date:
- A4
- Number:
- Time:
- Revision:
- Sheet
- of
- File:

### Library data of the parts
C9 = CMP-2000-05393-1: as C1 on sheet CarrierBoard; Manufacturer URL: http://www.tdk.com/; Category: Capacitors; Mounting Type: SurfaceMount,MLCC; Datasheet Version: Mar-15; Datasheet URL: http://www.farnell.com/datasheets/1913358.pdf; Packaging: CutTape(CT); Standard Package: 1; Features: -; Operating Temperature: -55degC~125degC; Tolerance: ±10%; RoHS Information: RoHSCertificate-MLCC; Applications: GeneralPurpose; Lead Style: -; Ratings: -; Height - Seated (Max): -; Lead Spacing: -; Package / Case: 0402(1005Metric); Series: C; Family: CeramicCapacitors
DIV_BAT RECEPTOR = CMP-1241-00231-1: 1.0 mm Pitch Easy-On(TM) Type FPC Connector, 3.0 mm Mated Height, Right Angle, ZIF, SMT, Bottom Contact, 8 Circuits, -40 to 85 degC, ELV and RoHS Compliant, Tape and Reel; Manufacturer: Molex; Mated Height: 3.00mm; PCB Retention: Yes; Voltage (Max): 50V AC (RMS)/DC; Material - Metal: Phosphor Bronze; PCB Locator: No; Circuits (Loaded): 8; Material - Plating Termination: Tin-Bismuth; Entry Angle: 90degrees Angle; Pitch - Mating Interface: 1.00mm; Current (Max per Contact): 0.5A; Durability (mating cycles max): 30; PackageReference: 52271-0879; PackageDescription: 8-Lead FPC Connector, Pitch 1.0 mm; Mounting Technology: Surface Mount; ComponentLink1URL: http://www.molex.com/molex/index.jsp; Number of Rows: 1; PackageVersion: Rev. B, 04/2004; ComponentLink1Description: Manufacturer URL; Contact Position: Bottom; RoHS: TRUE; ComponentLink3URL: http://www.molex.com/pdm_docs/sd/522710879_sd.pdf; PartNumber: 52271-0879; Orientation: Right Angle; Stackable: No; ComponentLink2URL: http://www.molex.com/webdocs/datasheets/pdf/en-us/0522710879_FFC_FPC_CONNECTORS.pdf; ComponentLink3Description: Package Specification; ComponentLink2Description: Datasheet; Polarized to PCB: Yes; Packing: Tape and Reel; Material - Plating Mating: Tin-Bismuth; Pitch - Termination Interface: 1.00mm
ENCODER ESC = 53398-0771: 7 way SMT straight header Molex PICOBLADE Series, Series Number 53398, 1.25mm Pitch 7 Way 1 Row Straight PCB Header, Solder Termination, 1A; Allied_Number: 70373150; Manufacturer_Name: Molex; Manufacturer_Part_Number: 53398-0771; RS Part Number: 5427220P; RS Price/Stock: http://uk.rs-online.com/web/p/products/5427220P; Allied Price/Stock: http://www.alliedelec.com/molex-incorporated-53398-0771/70373150/; Arrow Part Number: 53398-0771; Arrow Price/Stock: http://uk.rs-online.com/web/p/products/5427220P; Datasheet Link: http://www.molex.com/webdocs/datasheets/pdf/en-us/0533980771_PCB_HEADERS.pdf
R8-R10 R16-R20 = CMP-1011-00623-1: 10K 0.063W 1% 0402 (1005 Metric)  SMD; Manufacturer: Vishay; Manufacturer Part Number: ERJ-2RKF1002X; Case-Metric: 1005; Value: 10000.00 Ohm; Case-EIA: 0402; Power Rating: 62.5mW; Resistance: 10kR; Temperature Coefficient: 100ppm/°C; Tolerance: 1 %; Technology: SMT; Power: 0.063 W; Supplier 1: Mouser; Supplier Part Number 1: 71-CRCW040210K0FKEDC; Stock 1: 1778155; Pricing 1: 1=0.13, 10=0.051, 50=0.051, 100=0.029, 1000=0.029, 10000=0.005 (USD); Mount: Surface Mount; Case/Package: Molded; Contact Plating: Tin; Min Operating Temperature: -55°C; Max Operating Temperature: 155°C; Composition: Thick Film; Termination: Wraparound; Length: 1mm; Lead Free: Lead Free
R11-R15 = CMP-1011-00708-1: 56K 0.063W 1% 0402 (1005 Metric)  SMD; Manufacturer: Bourns; Manufacturer Part Number: CR0402-FX-5602GLF; Value: 56000.00 Ohm; Case-EIA: 0402; Case-Metric: 1005; Resistance: 56kR; Power Rating: 62.5mW; Voltage Rating: 50V; Temperature Coefficient: 100ppm/°C; Max Power Dissipation: 63mW; Tolerance: 1 %; Power: 0.063 W; Technology: SMT; Supplier 1: Mouser; Supplier Part Number 1: 652-CR0402FX-5602GLF; Stock 1: 37564; Pricing 1: 1=0.1, 10=0.022, 50=0.022, 100=0.013, 1000=0.008, 10000=0.005 (USD); Mount: Surface Mount; Case/Package: 0402; Case Code (Imperial): 0402; Case Code (Metric): 1005; Contact Plating: Tin; Min Operating Temperature: -55°C; Max Operating Temperature: 125°C; Packaging: Tape and Reel; Package Quantity: 1; Composition: Thick Film; Termination: SMD/SMT; Number of Terminations: 2; Military Standard: Not; Length: 1mm; Height: 0.016inch; Width: 0.5mm; Depth: 0.5mm; Thickness: 356um; Radiation Hardening: No; ComponentLink1URL: https://www.bourns.com/docs/Product-Datasheets/CR0402.pdf?src-supplier=Digi-Key; ComponentLink1Description: https://www.bourns.com/docs/Product-Datasheets/CR0402.pdf?src-supplier=Digi-Key; ComponentLink2URL: http://www.bourns.com/pdfs/CR0402.pdf?src-supplier=Avnet; ComponentLink2Description: http://www.bourns.com/pdfs/CR0402.pdf?src-supplier=Avnet
U4 = CMP-1633-00148-1: 8-Line To 1-Line Data Selectors/Multiplexers, D0016A, LARGE T&R; Manufacturer: Texas Instruments; VCC(Max)(V): 5.25; Configuration: "16","1"; Channels(#): 1; F @ Nom Voltage(Max)(Mhz): 35; Input Type: TTL; Output Drive (IOL/IOH)(Max)(mA): 8/-0.4; Voltage(Nom)(V): 5; Bits(#): 16; VCC(Min)(V): 4.75; Technology Family: LS; tpd @ Nom Voltage(Max)(ns): 38; Function: Encoder/Multiplexer; Schmitt Trigger: No; Rating: Catalog; ICC @ Nom Voltage(Max)(mA): 10; PartNumber: SN74LS151DR; Operating Temperature Range(C): 0 to 70; Type: Standard; ComponentLink3URL: http://www.ti.com/lit/ml/mpds178g/mpds178g.pdf; ComponentLink1Description: Manufacturer URL; ComponentLink2Description: Datasheet; DatasheetVersion: SDLS054; Output Type: TTL; PackageReference: D0016A; ComponentLink1URL: http://www.ti.com/; Code_JEDEC: MS-012 variation AC; ComponentLink2URL: http://www.ti.com/lit/ds/symlink/sn74ls151.pdf; ComponentLink3Description: Package Specification; Generic Part Number: SN74LS151

## Sheet Morpheus.SchDoc: Sanhaço - Morpheus
size A4; DocumentNumber: CB05; Revision: 1.1; SheetNumber: 5; SheetTotal: 5
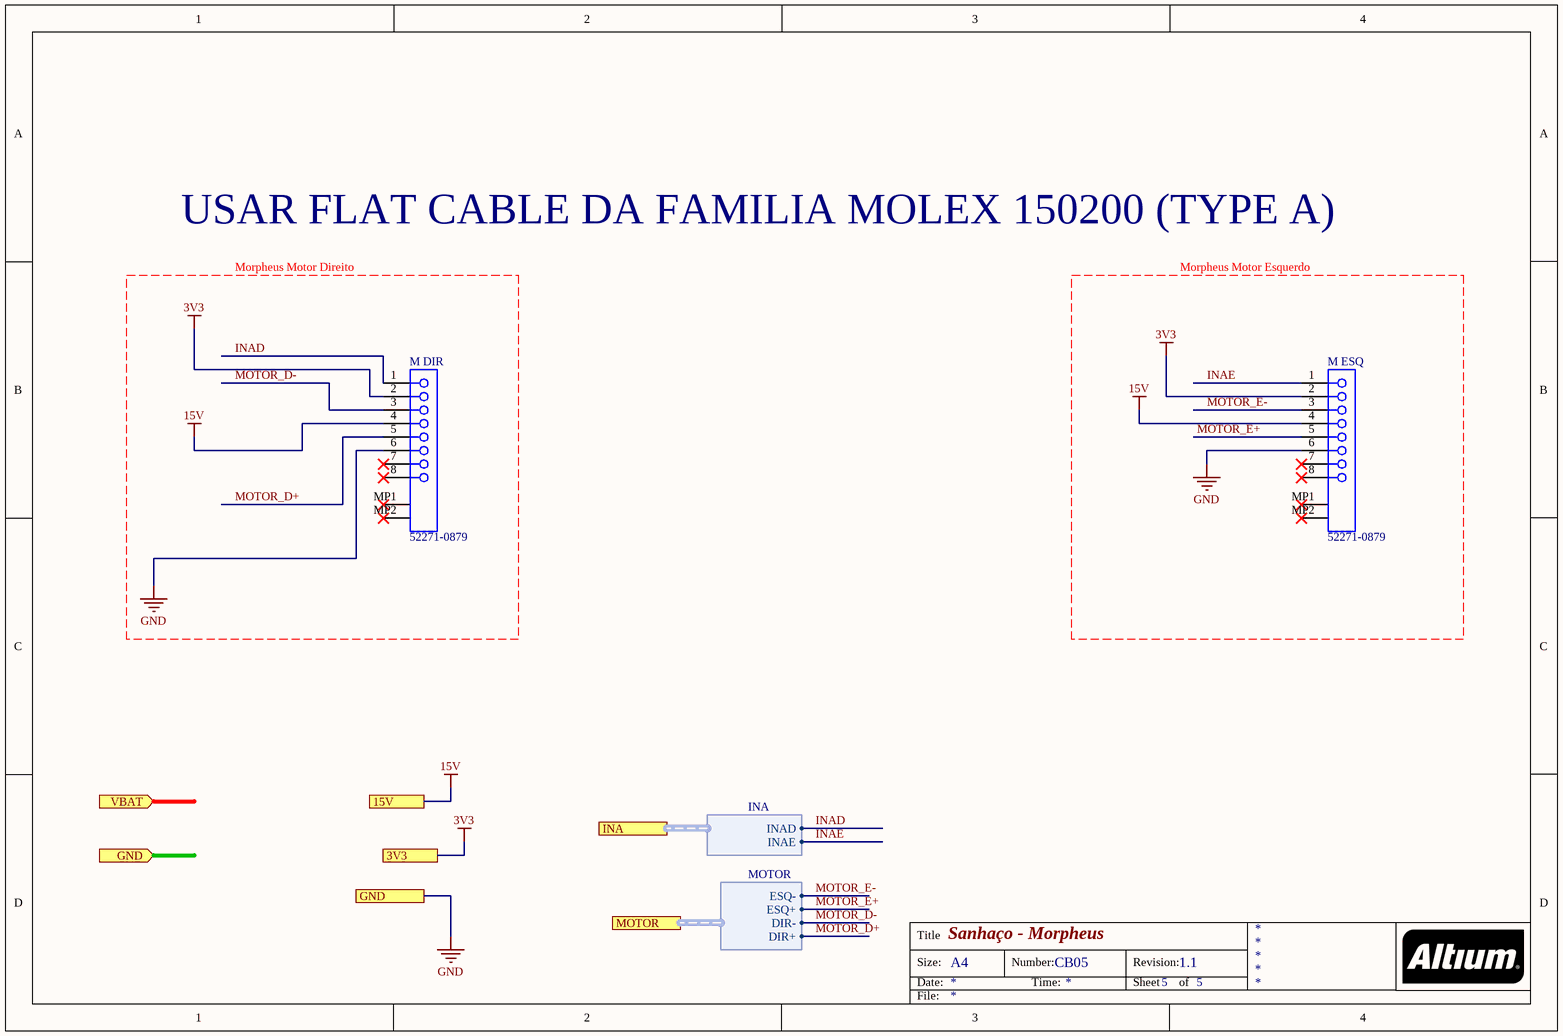
[diagram p4: Morpheus.SchDoc]

### Parts
M_DIR  52271-0879  [MOLX-52271-0879]
M_ESQ  52271-0879  [MOLX-52271-0879]

### Ports
3V3, 15V, GND, GND (in), INA (harness INA), MOTOR (harness MOTOR), VBAT (in)

### Harnesses
MOTOR: ESQ+, DIR-, DIR+, ESQ-
INA: INAD, INAE

### Nets
3V3: M_DIR.2 M_ESQ.2 ; port 3V3
15V: M_DIR.4 M_ESQ.4 ; port 15V
GND: M_DIR.6 M_ESQ.6 ; port GND  [project net 0]
INAD: M_DIR.1 ; port INA.INAD
INAE: M_ESQ.1 ; port INA.INAE
MOTOR_D+: M_DIR.5 ; port MOTOR.DIR+
MOTOR_D-: M_DIR.3 ; port MOTOR.DIR-
MOTOR_E+: M_ESQ.5 ; port MOTOR.ESQ+
MOTOR_E-: M_ESQ.3 ; port MOTOR.ESQ-

Not connected (* = marked no-connect by the designer): M_DIR 7* 8* MP1* MP2*; M_ESQ 7* 8* MP1* MP2*

### Notes on the sheet
- USAR FLAT CABLE DA FAMILIA MOLEX 150200 (TYPE A)
- Morpheus Motor Direito
- Morpheus Motor Esquerdo
- Title
- Size:
- Date:
- A4
- Number:
- Time:
- Revision:
- Sheet
- of
- File:

### Library data of the parts
M_DIR M_ESQ = CMP-1241-00231-1: as DIV_BAT on sheet CircuitoControle; PackageReference: 52271-0879; PackageDescription: 8-Lead FPC Connector, Pitch 1.0 mm; Mounting Technology: Surface Mount; ComponentLink1URL: http://www.molex.com/molex/index.jsp; Number of Rows: 1; PackageVersion: Rev. B, 04/2004; ComponentLink1Description: Manufacturer URL; Contact Position: Bottom; RoHS: TRUE; ComponentLink3URL: http://www.molex.com/pdm_docs/sd/522710879_sd.pdf; PartNumber: 52271-0879; Orientation: Right Angle; Stackable: No; ComponentLink2URL: http://www.molex.com/webdocs/datasheets/pdf/en-us/0522710879_FFC_FPC_CONNECTORS.pdf; ComponentLink3Description: Package Specification; ComponentLink2Description: Datasheet; Polarized to PCB: Yes; Packing: Tape and Reel; Material - Plating Mating: Tin-Bismuth; Pitch - Termination Interface: 1.00mm

## Nets that join several sheets
0: CarrierBoard (14 pins), Regulador5V (10 pins), Perifericos (7 pins), CircuitoControle (15 pins), Morpheus (M_DIR.6 M_ESQ.6)
3V3: CarrierBoard (C1.2 C2.2 R7.2 U1.2), Perifericos (8 pins), Morpheus (M_DIR.2 M_ESQ.2)
5V: CarrierBoard (R2.1 R6.2), Regulador5V (6 pins), CircuitoControle (7 pins)
15V: CarrierBoard (C7.2 C8.2 U2.3), Morpheus (M_DIR.4 M_ESQ.4)
BAT2S: CarrierBoard (R1.1), CircuitoControle (R14.1 R19.2 U3.8)
INAD: CircuitoControle (U3.14), Morpheus (M_DIR.1)
INAE: CircuitoControle (U3.13), Morpheus (M_ESQ.1)
INT: Perifericos (U6.12), CircuitoControle (U3.4)
MOTOR_D+: CircuitoControle (U3.34), Morpheus (M_DIR.5)
MOTOR_D-: CircuitoControle (U3.33), Morpheus (M_DIR.3)
MOTOR_E+: CircuitoControle (U3.36), Morpheus (M_ESQ.5)
MOTOR_E-: CircuitoControle (U3.35), Morpheus (M_ESQ.3)
NetC13_2: CarrierBoard (R1.2 R3.2 R4.1), Regulador5V (5 pins)
SPI_CS: Perifericos (U6.22), CircuitoControle (U3.40)
SPI_MISO: Perifericos (U6.9), CircuitoControle (U3.38)
SPI_MOSI: Perifericos (U6.24), CircuitoControle (U3.37)
SPI_SCK: Perifericos (U6.23), CircuitoControle (U3.39)
UART_RX: Perifericos (U5.RX), CircuitoControle (U3.15)
UART_TX: Perifericos (U5.TX), CircuitoControle (U3.16)